# EasyEDA schematic Maharani_Singleboard-project.json
TITLE: Sheet_1; REV: 1.0; Date: 2024-10-27; Sheet: 1/1; Company: Your Company
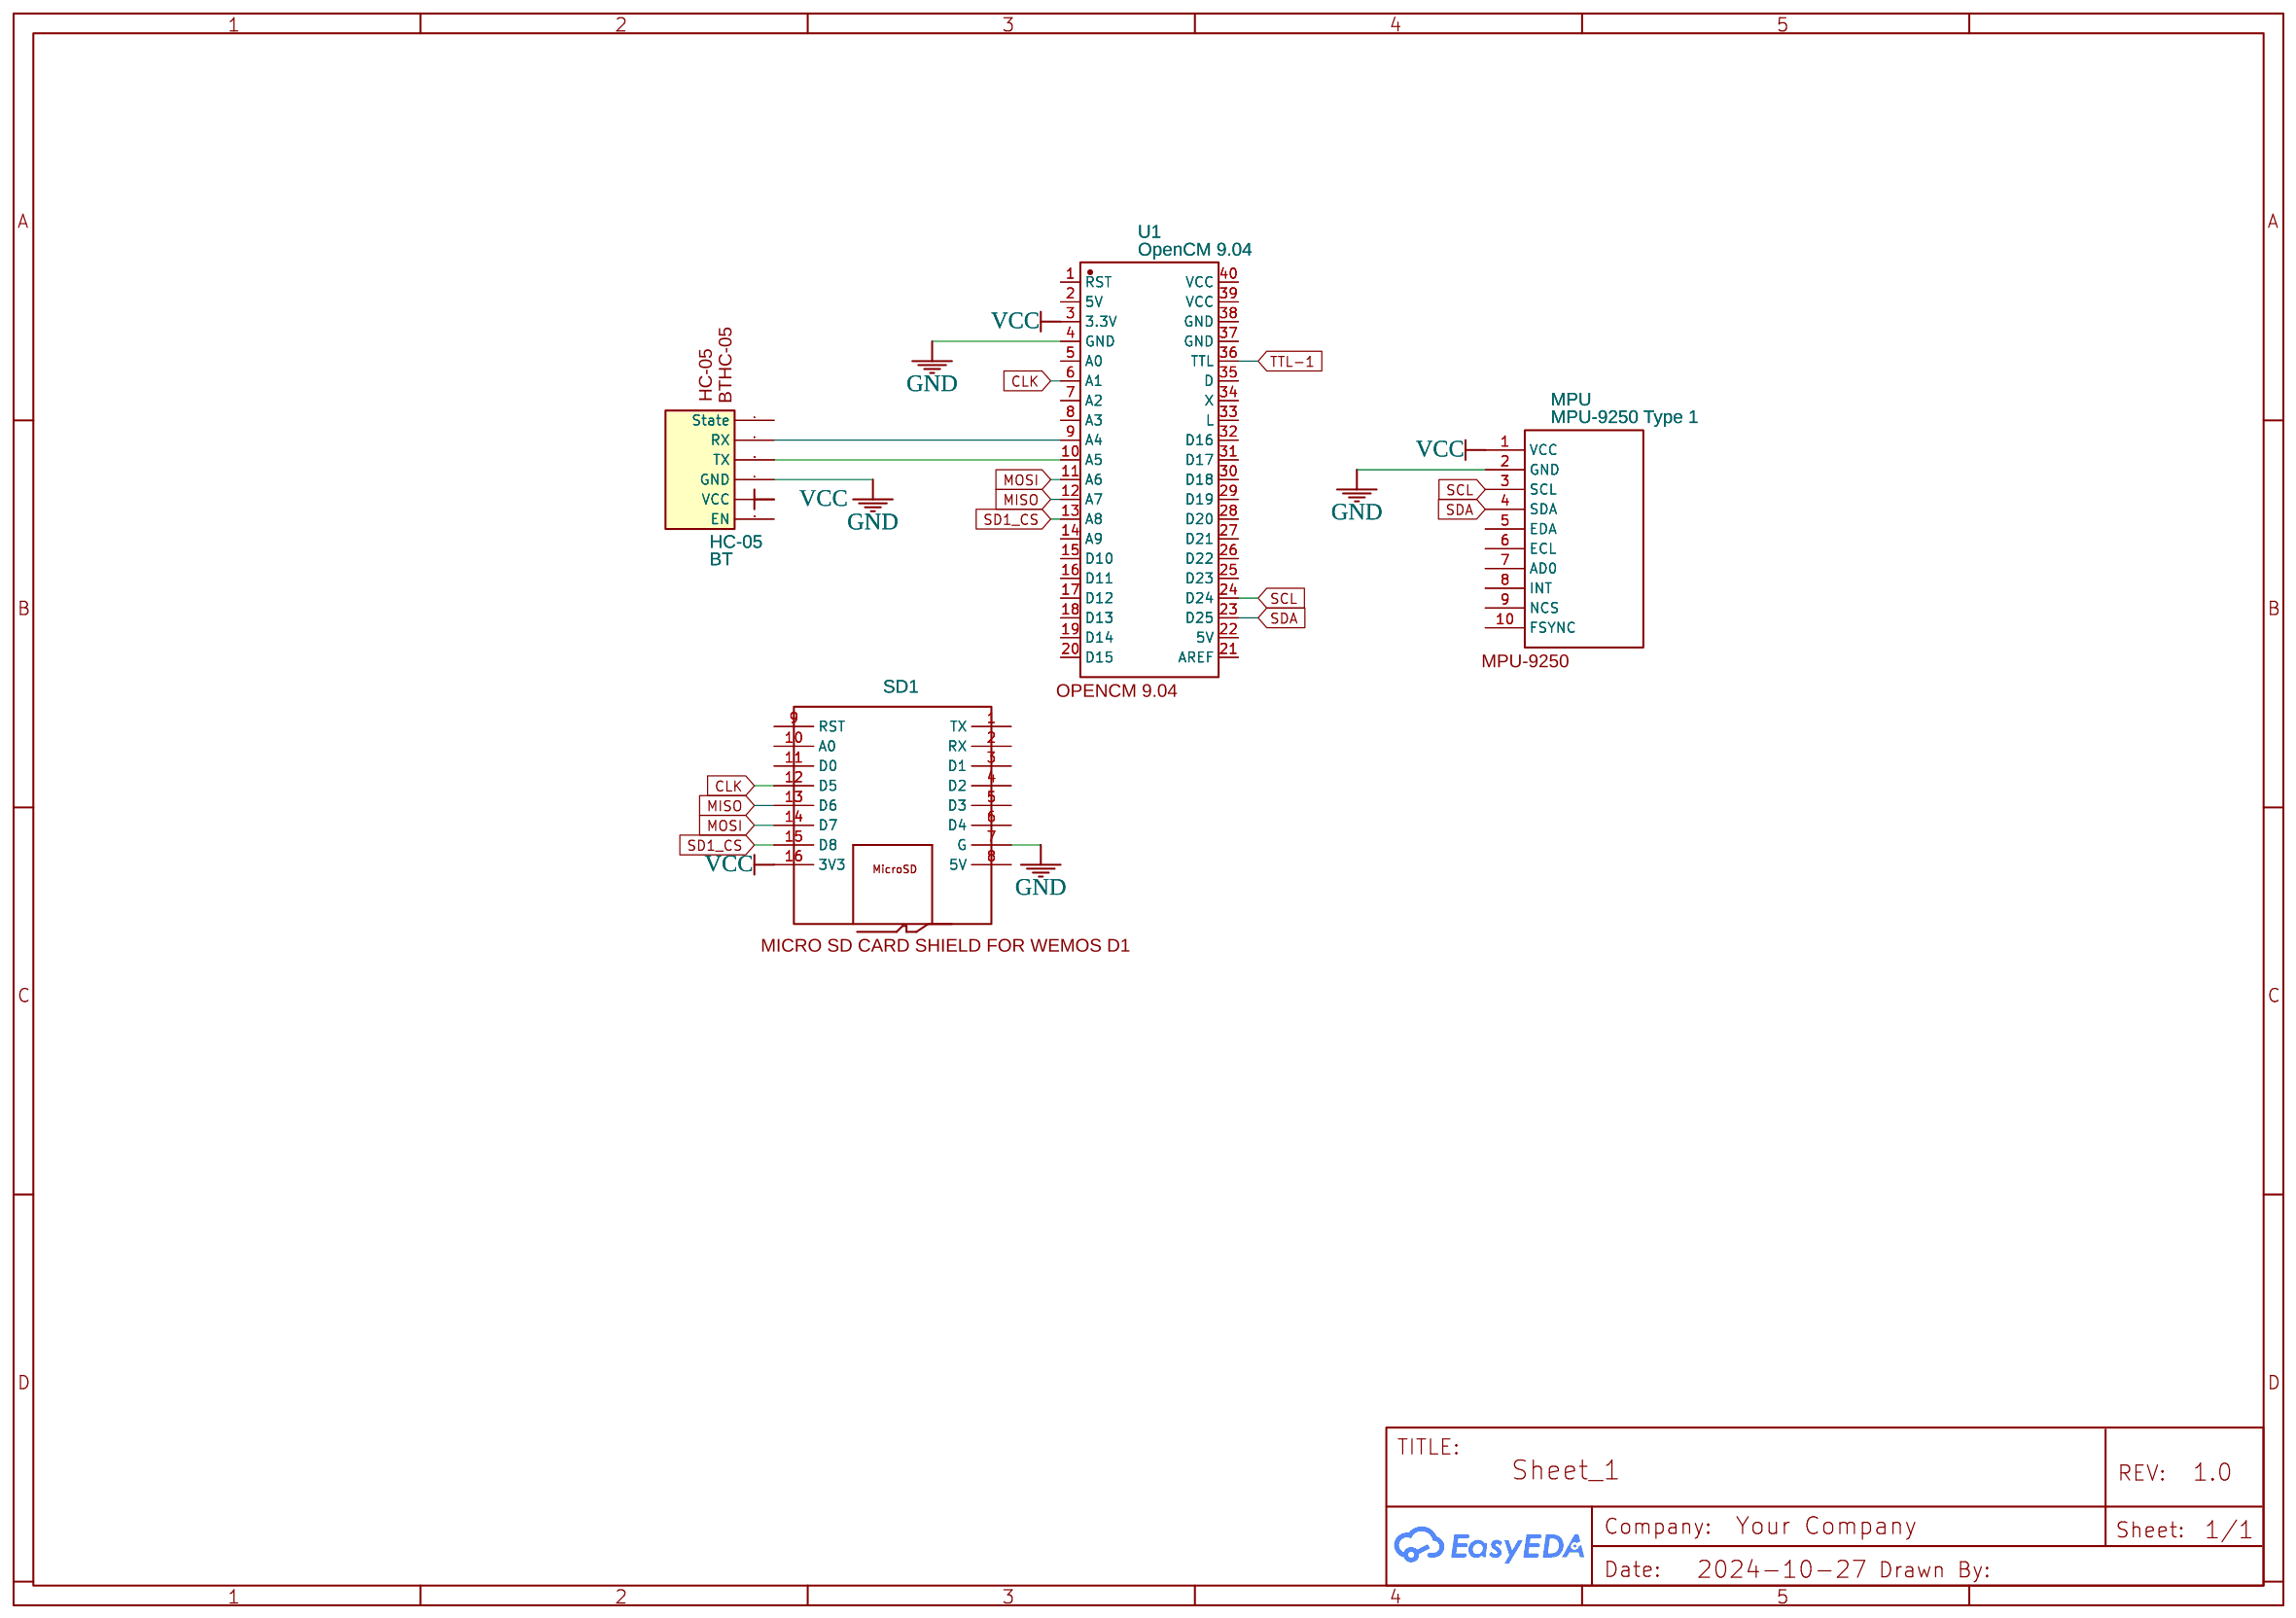
[diagram p0: schematic sheet]

## Parts
BT  HC-05  [HC-05]
MPU  MPU-9250 Type 1  [MPU-9250]
SD1  micro SD CARD module (Wemos d1)  [MICRO SD CARD SHIELD FOR WEMOS D1]
U1  OpenCM 9.04  [OPENCM 9.04]

## Library data of the parts
BT = HC-05: Contributor: marius.moesinger; Package Display: No
MPU = MPU-9250 Type 1: Supplier Part: MPU-92.65; Supplier: TaoBao; Contributor: loyboy; Package Display: Yes
SD1 = micro SD CARD module (Wemos d1): Manufacturer Part: GREATZT 1pcs Micro SD card mini TF card reader module; Supplier: Aliexpress; Contributor: almido; Package Display: Yes
U1 = OpenCM 9.04: Contributor: Ahmad Amiruddin; Package Display: Yes

## Nets
GND: BT.4(GND) MPU.2(GND) SD1.7(G) U1.4(GND)
VCC: BT.5(VCC) MPU.1(VCC) SD1.16(3V3) U1.3(3.3V)
CLK: SD1.12(D5) U1.6(A1)
MISO: SD1.13(D6) U1.12(A7)
MOSI: SD1.14(D7) U1.11(A6)
SCL: MPU.3(SCL) U1.24(D24)
SD1_CS: SD1.15(D8) U1.13(A8)
SDA: MPU.4(SDA) U1.23(D25)
TTL-1: U1.36(TTL)
Net-(BT-2): BT.2(RX) U1.9(A4)
Net-(BT-3): BT.3(TX) U1.10(A5)

Not connected (* = marked no-connect by the designer): BT 1(State) 6(EN); MPU 5(EDA) 6(ECL) 7(AD0) 8(INT) 9(NCS) 10(FSYNC); SD1 1(TX) 2(RX) 3(D1) 4(D2) 5(D3) 6(D4) 8(5V) 9(RST) 10(A0) 11(D0); U1 1(RST) 2(5V) 5(A0) 7(A2) 8(A3) 14(A9) 15(D10) 16(D11) 17(D12) 18(D13) 19(D14) 20(D15) 21(AREF) 22(5V) 25(D23) 26(D22) 27(D21) 28(D20) 29(D19) 30(D18) 31(D17) 32(D16) 33(L) 34(X) 35(D) 37(GND) 38(GND) 39(VCC) 40(VCC)
